# Altium project smallLCboard_Project.PrjPcb
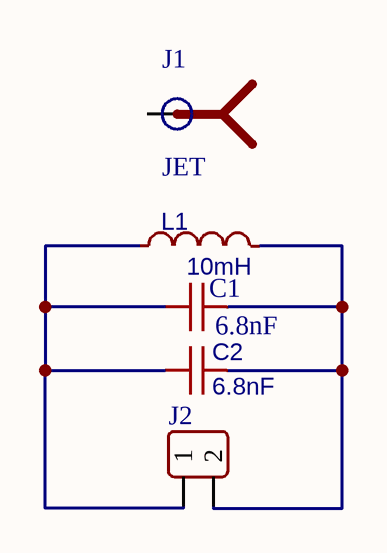
[diagram p0: LC.SchDoc]
1 sheet, 5 parts. Net scope: global (net labels, ports and power ports of the same name join across sheets).
Board files: LC.PcbDoc, smallLCboard.PcbDoc

## Sheet LC.SchDoc
size A2

### Parts
C1  6.8nF  [CAP3]
C2  6.8nF  [CAP_0603]
J1  JET  [M_KONG_springChange]
J2  Header  [Header H 2.54X2]  (value not drawn)
L1  10mH  [Inductor_8x10]

### Nets
NetC1_1: C1.1 C2.1 J2.1 L1.1
NetC1_2: C1.2 C2.2 J2.2 L1.2

Not connected (* = marked no-connect by the designer): J1 1

### Library data of the parts
C1 = CAP_聚苯电容
C2 = CAP_0603: BOM_Manufacturer: Samsung Electro-Mechanics; BOM_Manufacturer Part: CL10B104KB8WPNC; nameAlias: Capacitance; Contributor: LCSC; BOM_Supplier: LCSC; BOM_Supplier Part: C307348; spicePre: C; spiceSymbolName: CL10B104KB8WPNC
J2 = Header 2.54_2
L1 = Inductor: BOM_Manufacturer: TDK; BOM_Manufacturer Part: NLV25T-330J-EF; nameAlias: Inductance; Contributor: LCSC; BOM_Supplier: LCSC; BOM_Supplier Part: C295130; spicePre: L; spiceSymbolName: NLV25T-330J-EF